# Altium schematic sheet MAIN.SchDoc
size A3; SheetNumber: 1; SheetTotal: 6
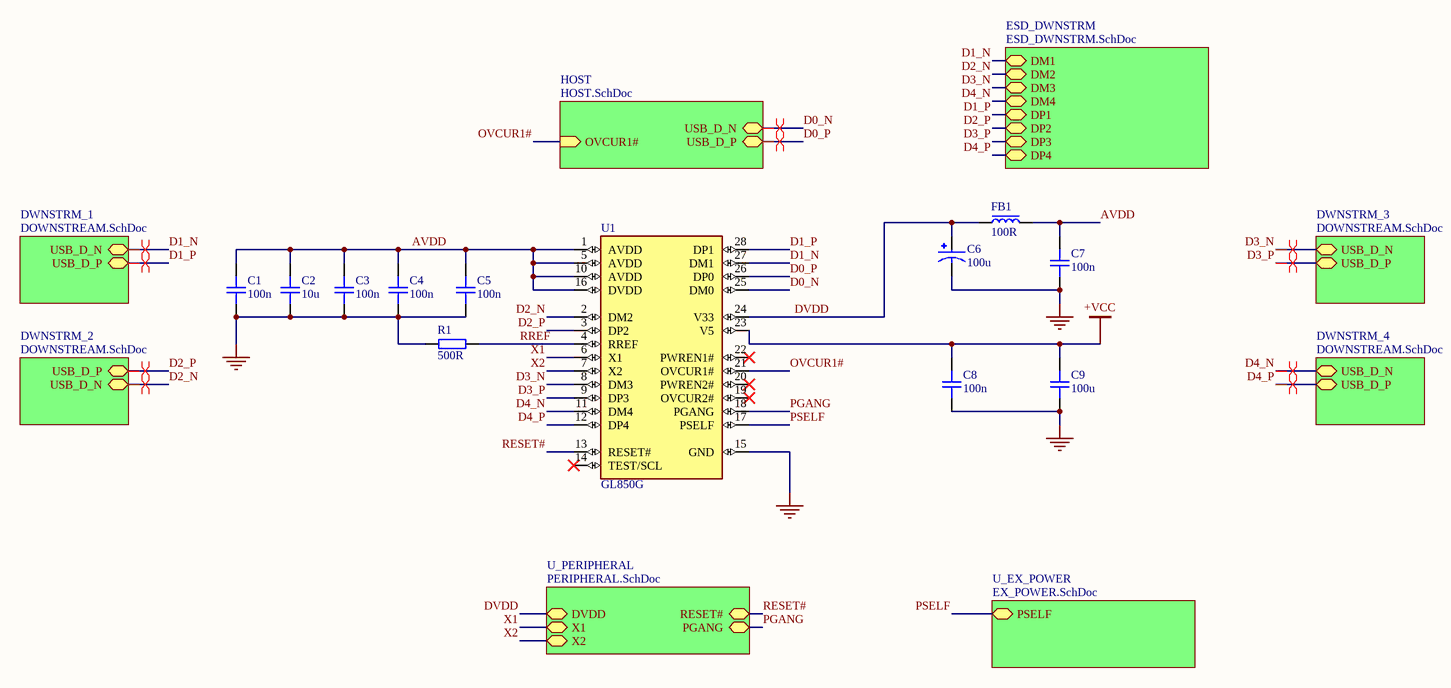
[diagram p0: MAIN.SchDoc]

## Parts
C1  100n  [CAP_0805]
C2  10u  [CAP_0805]
C3  100n  [CAP_0805]
C4  100n  [CAP_0805]
C5  100n  [CAP_0805]
C6  100u  [CAP_EEEHA0J101WR]
C7  100n  [CAP_0805]
C8  100n  [CAP_0805]
C9  100u  [CAP_0805]
FB1  100R  [FB_0603]
R1  500R  [RES_0603]
U1  GL850G  [SSOP28]

## Sub-sheets
DWNSTRM_1 = DOWNSTREAM.SchDoc: USB_D_N (bidir), USB_D_P (bidir)
DWNSTRM_2 = DOWNSTREAM.SchDoc: USB_D_N (bidir), USB_D_P (bidir)
DWNSTRM_3 = DOWNSTREAM.SchDoc: USB_D_N (bidir), USB_D_P (bidir)
DWNSTRM_4 = DOWNSTREAM.SchDoc: USB_D_N (bidir), USB_D_P (bidir)
ESD_DWNSTRM = ESD_DWNSTRM.SchDoc: DM1 (bidir), DM2 (bidir), DM3 (bidir), DM4 (bidir), DP1 (bidir), DP2 (bidir), DP3 (bidir), DP4 (bidir)
HOST = HOST.SchDoc: USB_D_N (bidir), USB_D_P (bidir), OVCUR1# (in)
U_EX_POWER = EX_POWER.SchDoc: PSELF (bidir)
U_PERIPHERAL = PERIPHERAL.SchDoc: RESET# (bidir), PGANG (bidir), DVDD (bidir), X1 (bidir), X2 (bidir)

## Nets
+VCC: C8.2 C9.2 U1.23(V5)
GND: C1.1 C2.1 C3.2 C4.1 C5.1 C6.2 C7.1 C8.1 C9.1 R1.1 U1.15(GND)
AVDD: C1.2 C2.2 C3.1 C4.2 C5.2 C7.2 FB1.2 U1.1(AVDD) U1.5(AVDD) U1.10(AVDD) U1.16(DVDD)
D0_N: U1.25(DM0) ; sheet HOST/USB_D_N
D0_P: U1.26(DP0) ; sheet HOST/USB_D_P
D1_N: U1.27(DM1) ; sheet DWNSTRM_1/USB_D_N, sheet ESD_DWNSTRM/DM1
D1_P: U1.28(DP1) ; sheet DWNSTRM_1/USB_D_P, sheet ESD_DWNSTRM/DP1
D2_N: U1.2(DM2) ; sheet DWNSTRM_2/USB_D_N, sheet ESD_DWNSTRM/DM2
D2_P: U1.3(DP2) ; sheet DWNSTRM_2/USB_D_P, sheet ESD_DWNSTRM/DP2
D3_N: U1.8(DM3) ; sheet DWNSTRM_3/USB_D_N, sheet ESD_DWNSTRM/DM3
D3_P: U1.9(DP3) ; sheet DWNSTRM_3/USB_D_P, sheet ESD_DWNSTRM/DP3
D4_N: U1.11(DM4) ; sheet DWNSTRM_4/USB_D_N, sheet ESD_DWNSTRM/DM4
D4_P: U1.12(DP4) ; sheet DWNSTRM_4/USB_D_P, sheet ESD_DWNSTRM/DP4
DVDD: C6.1 FB1.1 U1.24(V33) ; sheet U_PERIPHERAL/DVDD
OVCUR1#: U1.21(OVCUR1#) ; sheet HOST/OVCUR1#
PGANG: U1.18(PGANG) ; sheet U_PERIPHERAL/PGANG
PSELF: U1.17(PSELF) ; sheet U_EX_POWER/PSELF
RESET#: U1.13(RESET#) ; sheet U_PERIPHERAL/RESET#
RREF: R1.2 U1.4(RREF)
X1: U1.6(X1) ; sheet U_PERIPHERAL/X1
X2: U1.7(X2) ; sheet U_PERIPHERAL/X2

Not connected (* = marked no-connect by the designer): U1 14(TEST/SCL)* 19(OVCUR2#)* 20(PWREN2#)* 22(PWREN1#)*

## Layout directives
differential pair: D0_N, D0_P, D1_N, D1_P, D2_N, D2_P, D3_N, D3_P, D4_N, D4_P

## Library data of the parts
C1-C5 C7-C9 = CAP_0805: Capacitor SMD 0805; Manufacturer: *; Manufacturer Part Number: *; Distributor Link: *; LCSC: *; Rating: *; Dielectric: *
C6 = EEEHA0J101WR: CAPACITOR ALUM ELEC, 100UF, 20%, 6.3V, S; CAPACITOR ALUM ELEC, 100UF, 20%, 6.3V, SMD; Product Range:PANASONIC - HA Series; Capacitance:100ÂµF; Capacitance Tolerance:Â± 20%; Voltage Rating:6.3V; Capacitor Case Style:Radial Can - SMD; Diameter:5mm; Height:5.4mm; Series:HA; MF: Panasonic Electronic; MP: EEE-HA0J101WR; Availability: In Stock; Check_prices: https://www.snapeda.com/parts/EEE-HA0J101WR/Panasonic%20Electronic%20Components/view-part/2733110/?ref=eda; SnapEDA_Link: https://www.snapeda.com/parts/EEE-HA0J101WR/Panasonic%20Electronic%20Components/view-part/2733110/?ref=snap; Purchase-URL: https://pricing.snapeda.com/search/part/EEE-HA0J101WR/?ref=eda; Package: RADIAL-2 Panasonic; Value: *; Price: None
FB1 = FB_0603: Ferrite Bead SMD 0603; Manufacturer: *; Manufacturer Part Number: *; Distributor Link: *; LCSC: *
R1 = RES_0603: Resistor SMD 0603; Manufacturer: *; Manufacturer Part Number: *; Distributor Link: *; LCSC: *
U1 = GL850G: Programmable Logic IC Development Tools; Manufacturer: Vishay Intertechnology; SnapEDA_Link: https://www.snapeda.com/parts/GL850G/Vishay/view-part/?ref=snap; Availability: Not in stock; Check_prices: https://www.snapeda.com/parts/GL850G/Vishay/view-part/?ref=eda; Manufacturer Part Number: GL850G; Package: None; Price: None